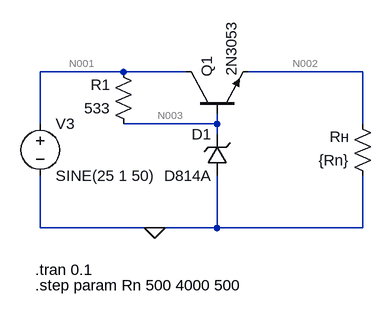
[diagram p0: schematic стабилизатор последовательный 2.asc]
стабилизатор последовательный 2.asc, the LTspice schematic file:
Version 4
SHEET 1 1044 680
WIRE 176 32 48 32
WIRE 272 32 176 32
WIRE 544 32 368 32
WIRE 48 112 48 32
WIRE 320 112 320 96
WIRE 320 112 176 112
WIRE 544 112 544 32
WIRE 320 128 320 112
WIRE 48 272 48 192
WIRE 224 272 48 272
WIRE 320 272 320 192
WIRE 320 272 224 272
WIRE 544 272 544 192
WIRE 544 272 320 272
FLAG 224 272 0
SYMBOL res 192 128 R180
WINDOW 0 36 76 Left 2
WINDOW 3 36 40 Left 2
SYMATTR InstName R1
SYMATTR Value 533
SYMBOL res 560 208 R180
WINDOW 0 36 76 Left 2
WINDOW 3 36 40 Left 2
SYMATTR InstName Rн
SYMATTR Value {Rn}
SYMBOL zener 336 192 R180
WINDOW 0 24 64 Left 2
WINDOW 3 24 0 Left 2
SYMATTR InstName D1
SYMATTR Value D814A
SYMATTR Description Diode
SYMATTR Type diode
SYMBOL voltage 48 96 R0
WINDOW 123 0 0 Left 0
WINDOW 39 0 0 Left 0
SYMATTR InstName V3
SYMATTR Value SINE(25 1 50)
SYMBOL npn 272 96 R270
WINDOW 3 58 70 Left 2
SYMATTR Value 2N3053
SYMATTR InstName Q1
TEXT 40 336 Left 2 !.tran 0.1
TEXT 40 360 Left 2 !.step param Rn 500 4000 500

The netlist it stands for:
* стабилизатор последовательный 2.asc
R1 N003 N001 533
Rн 0 N002 {Rn}
D1 0 N003 D814A
V3 N001 0 SINE(25 1 50)
Q1 N001 N003 N002 0 2N3053
.model D D
.lib standard.dio
.model NPN NPN
.model PNP PNP
.lib standard.bjt
.tran 0.1
.step param Rn 500 4000 500
.backanno
.end

* Results of the author's LTspice run, read from the files saved beside the schematic
* Operating Point (first step), zero values left out:
*   rn = 500 
*   V(n003) = 8.325 V
*   V(n001) = 25 V
*   V(n002) = 7.651 V
*   Ic(Q1) = 15.23 mA
*   Ib(Q1) = 66.48 µA
*   Ie(Q1) = -15.3 mA
*   I(D1) = -31.22 mA
*   I(Rн) = -15.3 mA
*   I(R1) = -31.29 mA
*   I(V3) = -46.52 mA
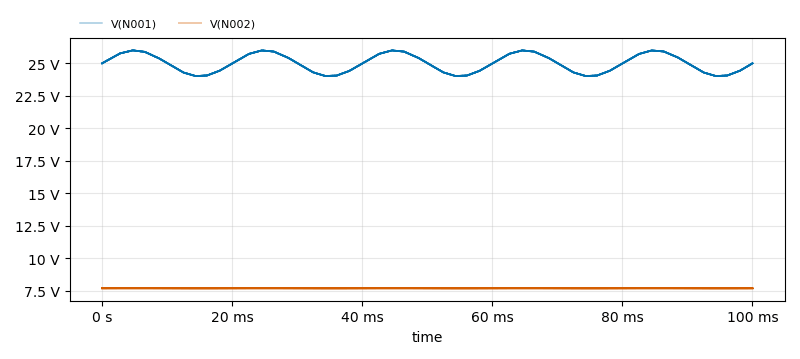
[diagram p1: Transient Analysis of стабилизатор последовательный 2.asc, plotted from the saved traces]
* Transient Analysis, 8 runs:
*   V(N001) [rn=500]: min 24.02 V, max 26 V, average 25 V, rms 25.01 V, last 25 V
*   V(N001) [rn=1000]: min 24.02 V, max 26 V, average 25 V, rms 25.01 V, last 25 V
*   V(N001) [rn=1500]: min 24.02 V, max 26 V, average 25 V, rms 25.01 V, last 25 V
*   V(N001) [rn=2000]: min 24.02 V, max 26 V, average 25 V, rms 25.01 V, last 25 V
*   V(N001) [rn=2500]: min 24.02 V, max 26 V, average 25 V, rms 25.01 V, last 25 V
*   V(N001) [rn=3000]: min 24.02 V, max 26 V, average 25 V, rms 25.01 V, last 25 V
*   V(N001) [rn=3500]: min 24.02 V, max 26 V, average 25 V, rms 25.01 V, last 25 V
*   V(N001) [rn=4000]: min 24.02 V, max 26 V, average 25 V, rms 25.01 V, last 25 V
*   V(N002) [rn=500]: min 7.647 V, max 7.655 V, average 7.651 V, rms 7.651 V, last 7.651 V
*   V(N002) [rn=1000]: min 7.666 V, max 7.674 V, average 7.67 V, rms 7.67 V, last 7.67 V
*   V(N002) [rn=1500]: min 7.676 V, max 7.684 V, average 7.68 V, rms 7.68 V, last 7.68 V
*   V(N002) [rn=2000]: min 7.684 V, max 7.692 V, average 7.688 V, rms 7.688 V, last 7.688 V
*   V(N002) [rn=2500]: min 7.69 V, max 7.698 V, average 7.694 V, rms 7.694 V, last 7.694 V
*   V(N002) [rn=3000]: min 7.695 V, max 7.703 V, average 7.699 V, rms 7.699 V, last 7.699 V
*   V(N002) [rn=3500]: min 7.699 V, max 7.707 V, average 7.703 V, rms 7.703 V, last 7.703 V
*   V(N002) [rn=4000]: min 7.702 V, max 7.71 V, average 7.706 V, rms 7.706 V, last 7.706 V